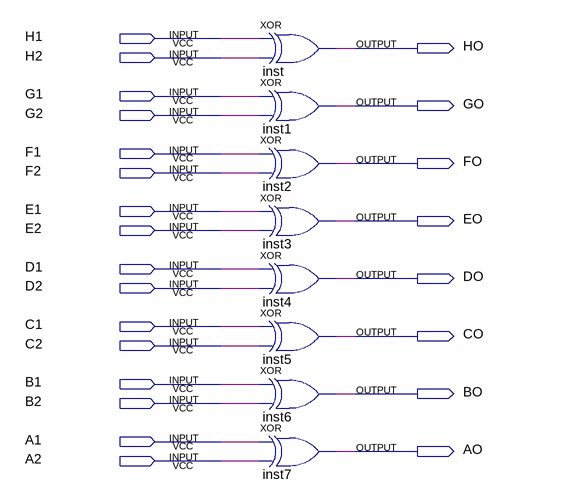
[diagram p0: schematic sheet]
// Quartus schematic XOR.bdf as structural Verilog: 8 symbols, 24 pins
module XOR (
  input  H1,
  input  H2,
  input  G1,
  input  G2,
  input  F1,
  input  F2,
  input  E1,
  input  E2,
  input  D1,
  input  D2,
  input  C1,
  input  C2,
  input  B1,
  input  B2,
  input  A1,
  input  A2,
  output HO,
  output GO,
  output FO,
  output EO,
  output DO,
  output CO,
  output BO,
  output AO
);

  xor inst (HO, H1, H2);
  xor inst1 (GO, G1, G2);
  xor inst2 (FO, F1, F2);
  xor inst3 (EO, E1, E2);
  xor inst4 (DO, D1, D2);
  xor inst5 (CO, C1, C2);
  xor inst6 (BO, B1, B2);
  xor inst7 (AO, A1, A2);
endmodule
